# Altium schematic sheet DogBLDC.SchDoc
size 840 x 594 mm; DocumentTitle: Плата управления объективами; ProjectTitle: Плата управления питанием; PageSetup: Record=PageOptions|CenterHorizontal=True|CenterVertical=True|PrintScale=1.04|XCorrection=1.00|YCorrection=1.00|PrintKind=2|BorderSize=5000000|LeftOffset=0|BottomOffset=0|Orientation=2|PaperLength=1000|PaperWidth=1000|Scale=100|PaperSource=7|PrintQuality=600|MediaType=1|DitherType=10|PaperKind=Oversize A1|PrintScaleMode=1; Weight: -; ScaleFactor: -; NormInspection: Норм.Контр.
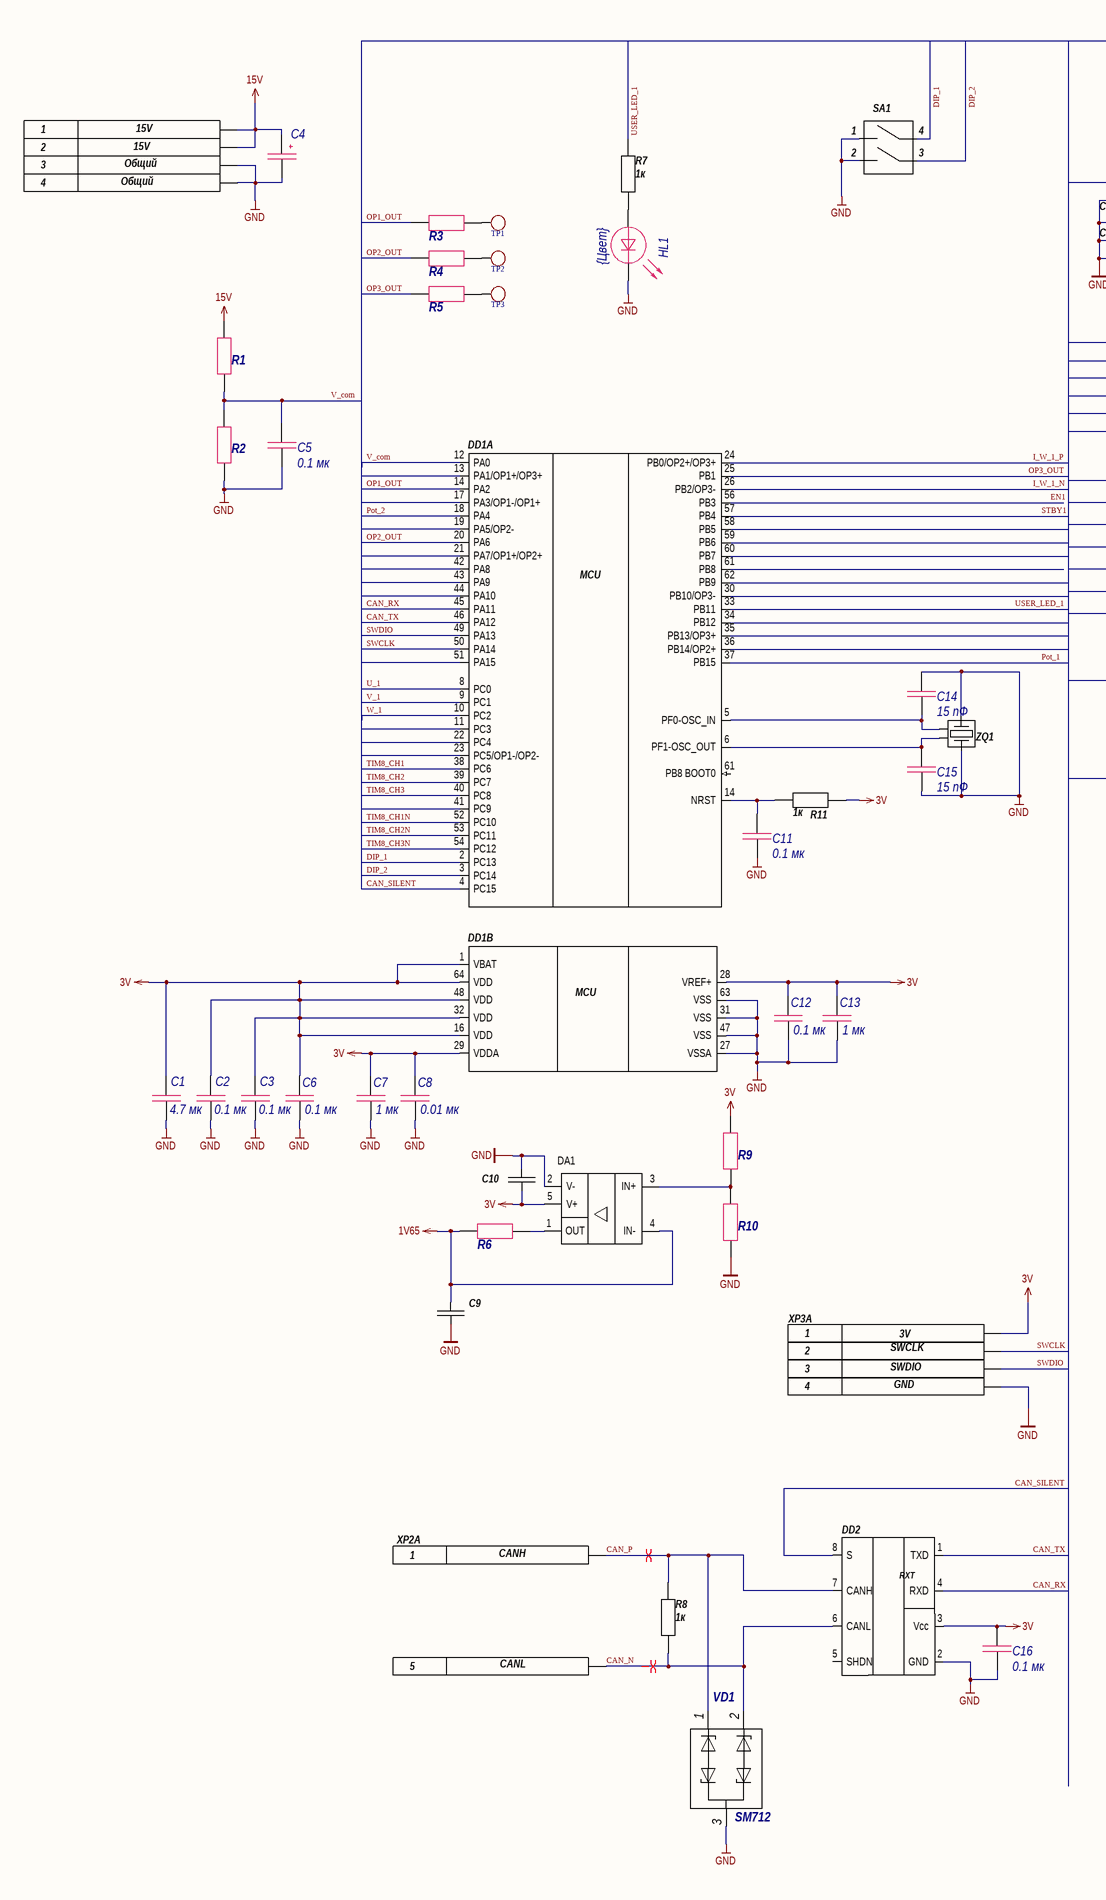
[diagram p0: DogBLDC.SchDoc, left]
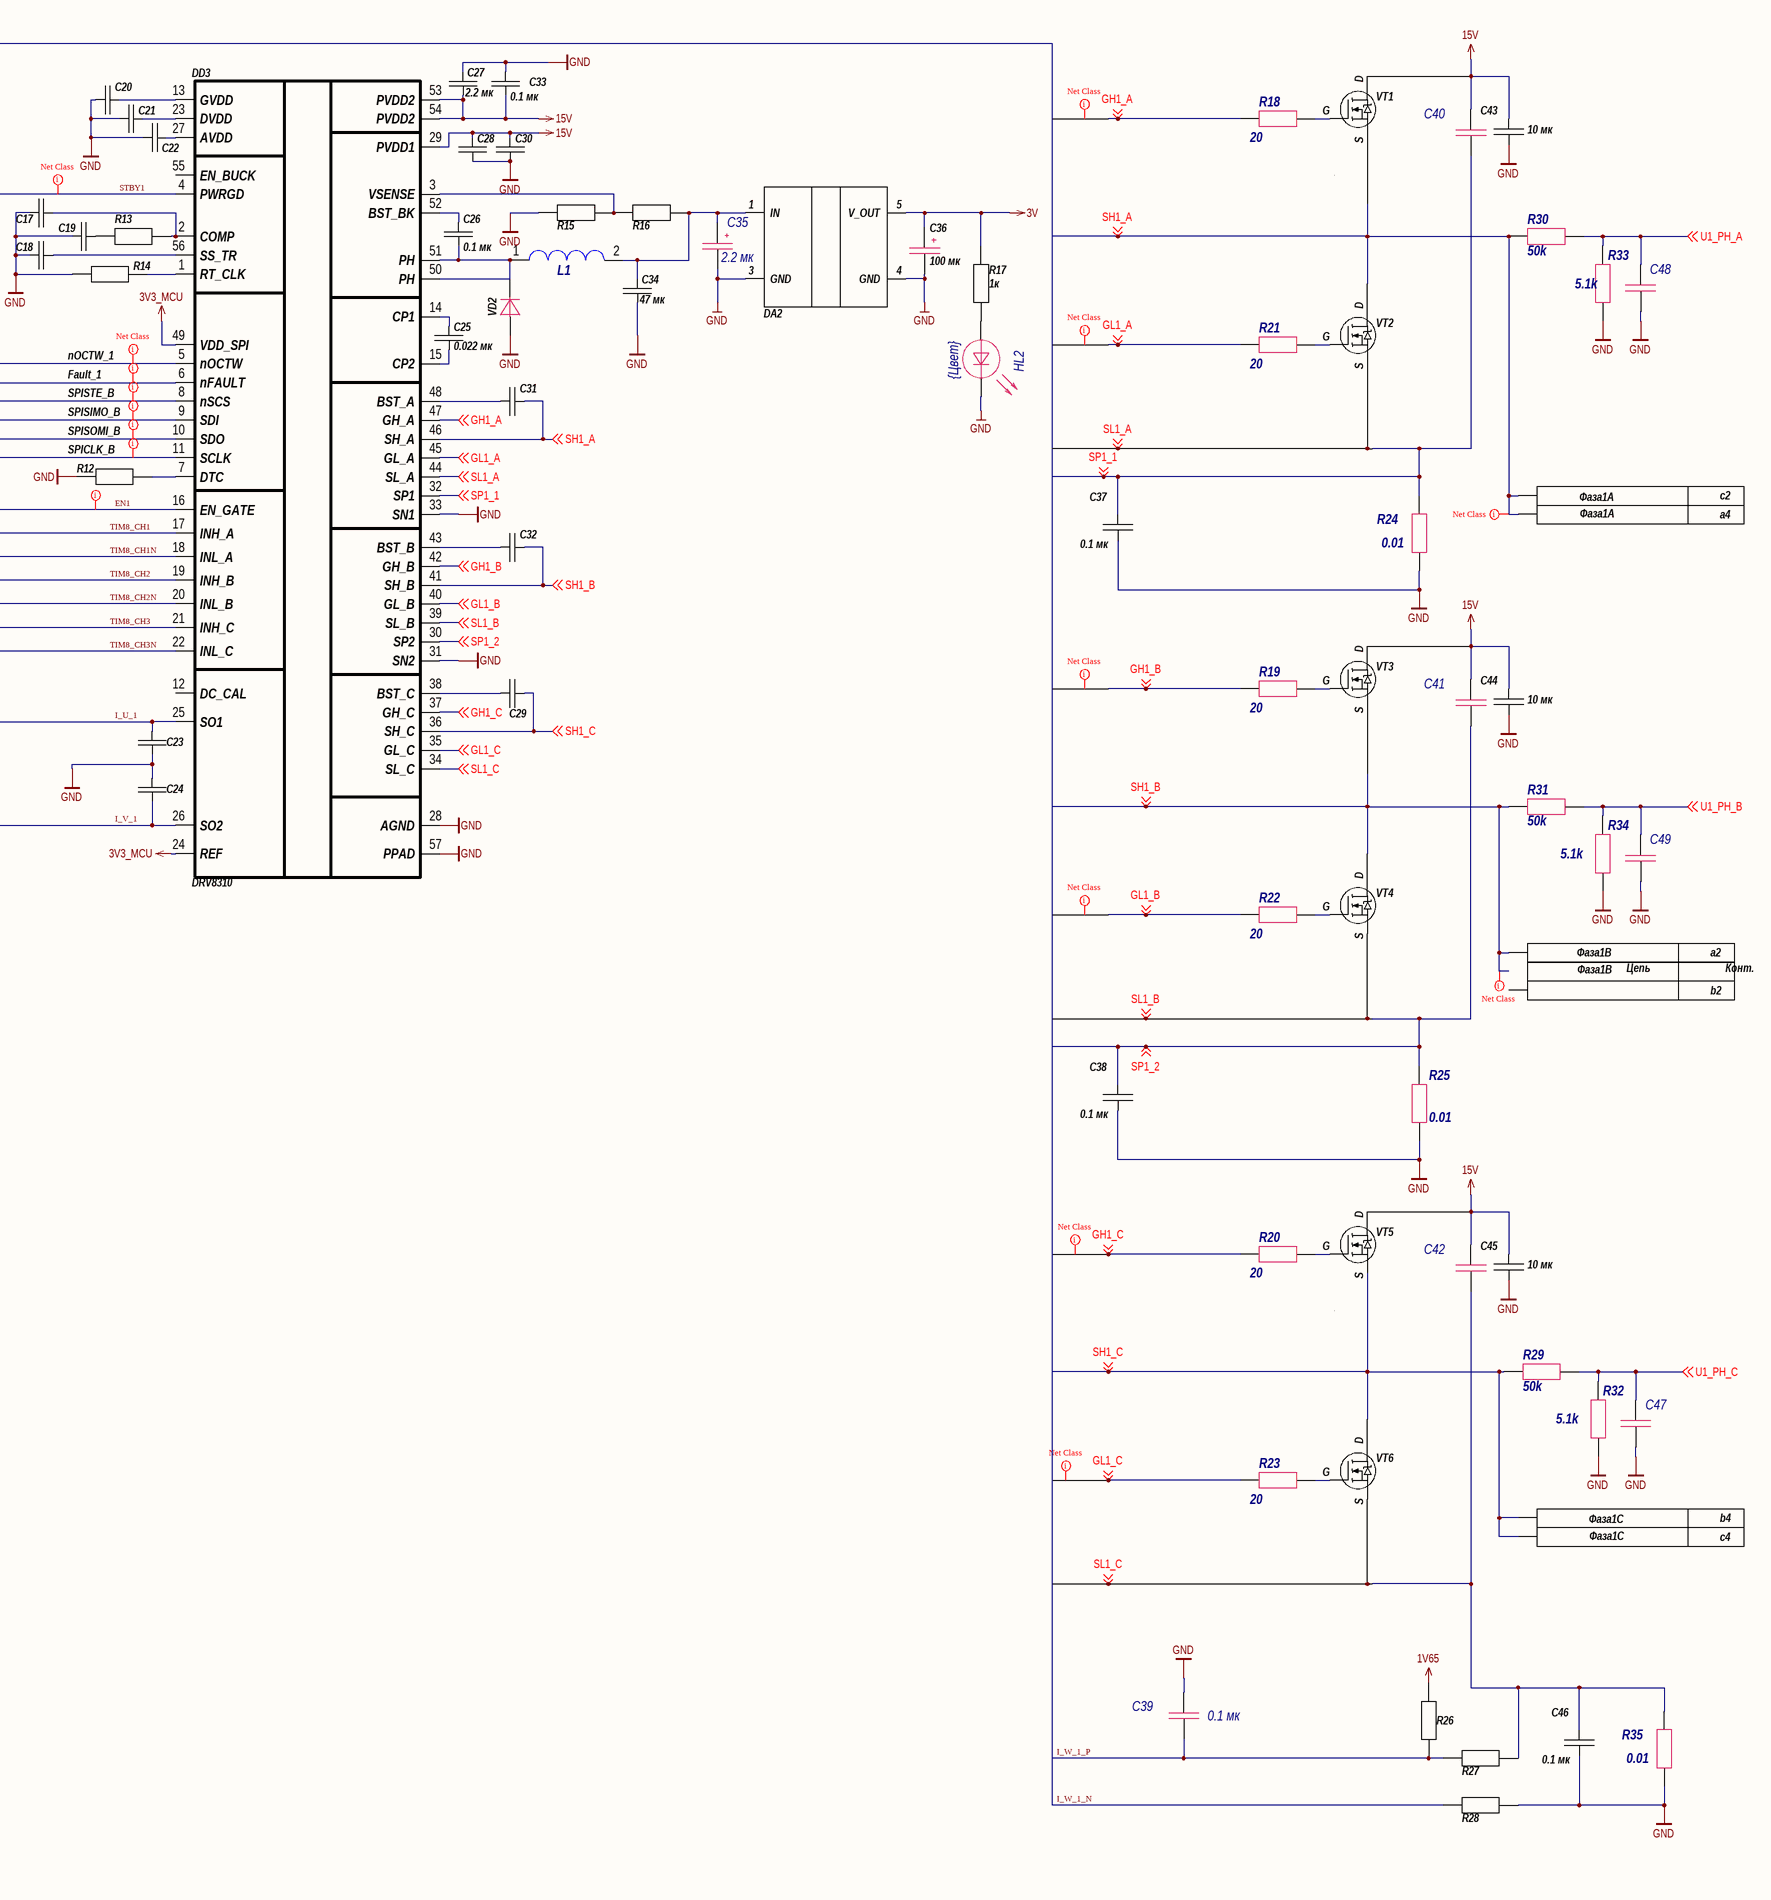
[diagram p1: DogBLDC.SchDoc, right]

## Parts
C1  value 4.7 мк  [0603cap]  (hidden comment: Capacitor)
C2  value 0.1 мк  [0603cap]  (hidden comment: Capacitor)
C3  value 0.1 мк  [0603cap]  (hidden comment: Capacitor)
C4  1uF  [TC_B (3528)]  (value not drawn)
C5  value 0.1 мк  [0603c]  (hidden comment: Capacitor)
C6  value 0.1 мк  [0603cap]  (hidden comment: Capacitor)
C7  value 1 мк  [0603cap]  (hidden comment: Capacitor)
C8  value 0.01 мк  [0603cap]  (hidden comment: Capacitor)
C9  C_1  [RES 0402]  (value not drawn)
C10  C_1  [RES 0402]  (value not drawn)
C11  value 0.1 мк  [0603cap]  (hidden comment: Capacitor)
C12  value 0.1 мк  [0603cap]  (hidden comment: Capacitor)
C13  value 1 мк  [0603cap]  (hidden comment: Capacitor)
C14  value 15 пФ  [0603cap]  (hidden comment: Capacitor)
C15  value 15 пФ  [0603cap]  (hidden comment: Capacitor)
C16  value 0.1 мк  [0603cap]  (hidden comment: Capacitor)
C17  C_1  [RES 0402]  (value not drawn)
C18  C_1  [RES 0402]  (value not drawn)
C19  C_1  [RES 0402]  (value not drawn)
C20  C_1  [0603c]  (value not drawn)
C21  C_1  [0603c]  (value not drawn)
C22  C_1  [0603c]  (value not drawn)
C23  C_1  [RES 0402]  (value not drawn)
C24  C_1  [RES 0402]  (value not drawn)
C25  value 0.022 мк  [0805]  (hidden comment: C_1)
C26  value 0.1 мк  [0603cap]  (hidden comment: C_1)
C27  value 2.2 мк  [1206 - duplicate]  (hidden comment: C_1)
C28  C_1  [0603cap]  (value not drawn)
C29  C_1  [0603cap]  (value not drawn)
C30  C_1  [0603cap]  (value not drawn)
C31  C_1  [0603cap]  (value not drawn)
C32  C_1  [0603cap]  (value not drawn)
C33  value 0.1 мк  [0603cap]  (hidden comment: C_1)
C34  value 47 мк  [1206 - duplicate]  (hidden comment: C_1)
C35  value 2.2 мк  [TC_A (3216)]  (hidden comment: 1uF)
C36  value 100 мк  [TC_D (7343)]  (hidden comment: 1uF)
C37  0.1 мк  [0603C]
C38  0.1 мк  [0603C]
C39  value 0.1 мк  [0603C]  (hidden comment: Capacitor)
C40  Capacitor  [CAP_2220]  (value not drawn)
C41  Capacitor  [CAP_2220]  (value not drawn)
C42  Capacitor  [CAP_2220]  (value not drawn)
C43  10 мк  [1812С]
C44  10 мк  [1812С]
C45  10 мк  [1812С]
C46  0.1 мк  [0603C]
C47  Capacitor  [RES 0402]  (value not drawn)
C48  Capacitor  [RES 0402]  (value not drawn)
C49  Capacitor  [RES 0402]  (value not drawn)
DA1  TLV2781  [SOT23-5]  (value not drawn)
DA2  TPS7B9xx  [SOT23_6_Pin]  (value not drawn)
DD1  STM32G431x6  [STM-LQFP64_L]  (value not drawn)  (parts A,B of 2)
DD2  TCAN337DCN  [SOT23-8]  (value not drawn)
DD3  DRV8310  [TSSOP50P810X120_HS-57N]
HL1  Color: {Цвет}  [0603D]
HL2  Color: {Цвет}  [0603D]
L1  DR74-330-R  [Inductor 6.3x6.3]  (value not drawn)
R1  Resistor  [RES 0402]  (value not drawn)
R2  Resistor  [RES 0402]  (value not drawn)
R3  Resistor  [RES 0402]  (value not drawn)
R4  Resistor  [RES 0402]  (value not drawn)
R5  Resistor  [RES 0402]  (value not drawn)
R6  Resistor  [RES 0402]  (value not drawn)
R7  value 1к  [0603res]  (hidden comment: Resistor)
R8  value 1к  [0603res]  (hidden comment: Resistor)
R9  Resistor  [RES 0402]  (value not drawn)
R10  Resistor  [RES 0402]  (value not drawn)
R11  value 1к  [0603res]  (hidden comment: Resistor)
R12  Resistor  [RES 0402]  (value not drawn)
R13  Resistor  [RES 0402]  (value not drawn)
R14  Resistor  [RES 0402]  (value not drawn)
R15  Resistor  [0603RES]  (value not drawn)
R16  Resistor  [0603RES]  (value not drawn)
R17  value 1к  [0603res]  (hidden comment: Resistor)
R18  value 20  [1206R]  (hidden comment: Resistor)
R19  value 20  [1206R]  (hidden comment: Resistor)
R20  value 20  [1206R]  (hidden comment: Resistor)
R21  value 20  [1206R]  (hidden comment: Resistor)
R22  value 20  [1206R]  (hidden comment: Resistor)
R23  value 20  [1206R]  (hidden comment: Resistor)
R24  value 0.01  [RES_LR2512]  (hidden comment: Resistor)
R25  value 0.01  [RES_LR2512]  (hidden comment: Resistor)
R26  Resistor  [RES 0402]  (value not drawn)
R27  Resistor  [RES 0402]  (value not drawn)
R28  Resistor  [RES 0402]  (value not drawn)
R29  value 50k  [0603R]  (hidden comment: Resistor)
R30  value 50k  [0603R]  (hidden comment: Resistor)
R31  value 50k  [0603R]  (hidden comment: Resistor)
R32  value 5.1k  [0603R]  (hidden comment: Resistor)
R33  value 5.1k  [0603R]  (hidden comment: Resistor)
R34  value 5.1k  [0603R]  (hidden comment: Resistor)
R35  value 0.01  [RES_LR2512]  (hidden comment: Resistor)
SA1  DIP переключатель 2  [SW-2]  (value not drawn)
TP1  TestPoint_1  [TP1]  (value not drawn)
TP2  TestPoint_1  [TP1]  (value not drawn)
TP3  TestPoint_1  [TP1]  (value not drawn)
VD1  SM712  [SOT23_true]
VD2  Diod  [SMB]  (value not drawn)
VT1  MOSFET GOST_PQFN5X6  [Power 5x6-8]  (value not drawn)
VT2  MOSFET GOST_PQFN5X6  [Power 5x6-8]  (value not drawn)
VT3  MOSFET GOST_PQFN5X6  [Power 5x6-8]  (value not drawn)
VT4  MOSFET GOST_PQFN5X6  [Power 5x6-8]  (value not drawn)
VT5  MOSFET GOST_PQFN5X6  [Power 5x6-8]  (value not drawn)
VT6  MOSFET GOST_PQFN5X6  [Power 5x6-8]  (value not drawn)
XP1  Value7: 15V  [G125-MS10605L3P]  (hidden comment: Конт.6_Вилка_ отд.контакты)  (parts A,B,C,D,E of 6)
XP2  Value1: CANH  [G125-MS10605L3P]  (hidden comment: Конт.6_Вилка_ отд.контакты)  (part A of 6)
XP3  Value1: 3V  Value2: SWCLK  Value3: SWDIO  Value4: GND  [PLL4]  (hidden comment: Конт.4_Single)  (parts A,B,C,D of 4)
XP4  Конт.48_Вилка_ отд.контакты  [DIN-Power E048MR-3,0C1-2-right_numbers]  (value not drawn)  (parts A,B,C,D,E,F of 48)
ZQ1  KX-7  [kx-7]  (value not drawn)

## Nets
1V65: C9.1 DA1.4(IN-) R6.2 R26.2
3V: C1.2 C2.2 C3.2 C6.2 C7.2 C8.2 C10.2 C12.2 C13.2 C16.2 C36.1 DA1.5(V+) DA2.5(V_OUT) DD1.1(VBAT) DD1.16(VDD) DD1.28(VREF+) DD1.29(VDDA) DD1.32(VDD) DD1.48(VDD) DD1.64(VDD) DD2.3(Vcc) R9.2 R11.1 R17.2 XP3.1
3V3_MCU: DD3.24(REF) DD3.49(VDD_SPI)
15V: C4.1 C27.1 C28.2 C30.2 C33.1 C40.1 C41.1 C42.1 C43.1 C44.1 C45.1 DD3.29(PVDD1) DD3.53(PVDD2) DD3.54(PVDD2) R1.1 VT1.D VT3.D VT5.D XP1.1 XP1.2
GND: C1.1 C2.1 C3.1 C4.2 C5.1 C6.1 C7.1 C8.1 C9.2 C10.1 C11.1 C12.1 C13.1 C14.2 C15.1 C16.1 C17.2 C18.2 C19.2 C20.1 C21.1 C22.1 C23.2 C24.1 C27.2 C28.1 C30.1 C33.2 C34.1 C35.2 C36.2 C37.2 C38.2 C39.1 C43.2 C44.2 C45.2 C46.2 C47.2 C48.2 C49.2 DA1.2(V-) DA2.3(GND) DA2.4(GND) DD1.27(VSSA) DD1.31(VSS) DD1.47(VSS) DD1.63(VSS) DD2.2(GND) DD3.28(AGND) DD3.31(SN2) DD3.33(SN1) DD3.57(PPAD) HL1.2 HL2.2 R2.2 R10.1 R12.1 R14.1 R15.2 R24.1 R25.1 R28.2 R32.2 R33.2 R34.2 R35.1 SA1.1 SA1.2 VD1.3(GND) VD2.1 XP1.3 XP1.4 XP3.4 ZQ1.1(XTAL1) ZQ1.3(XTAL2)
CAN_N: DD2.6(CANL) R8.1 VD1.2(IN2) XP1.5
CAN_P: DD2.7(CANH) R8.2 VD1.1(IN1) XP2.1
CAN_RX: DD1.45(PA11) DD2.4(RXD)
CAN_SILENT: DD1.4(PC15) DD2.8(S)
CAN_TX: DD1.46(PA12) DD2.1(TXD)
DIP_1: DD1.2(PC13) SA1.4
DIP_2: DD1.3(PC14) SA1.3
EN1: DD1.56(PB3) DD3.16(EN_GATE)
Fault_1: DD3.6(nFAULT)
GH1_A: DD3.47(GH_A) R18.1 ; off-sheet GH1_A
GH1_B: DD3.42(GH_B) R19.1 ; off-sheet GH1_B
GH1_C: DD3.37(GH_C) R20.1 ; off-sheet GH1_C
GL1_A: DD3.45(GL_A) R21.1 ; off-sheet GL1_A
GL1_B: DD3.40(GL_B) R22.1 ; off-sheet GL1_B
GL1_C: DD3.35(GL_C) R23.1 ; off-sheet GL1_C
I_U_1: C23.1 DD3.25(SO1)
I_V_1: C24.2 DD3.26(SO2)
I_W_1_N: DD1.26(PB2/OP3-) R28.1
I_W_1_P: C39.2 DD1.24(PB0/OP2+/OP3+) R26.1 R27.1
nOCTW_1: DD3.5(nOCTW)
OP1_OUT: DD1.14(PA2) R3.2
OP2_OUT: DD1.20(PA6) R4.2
OP3_OUT: DD1.25(PB1) R5.2
Pot_1: DD1.37(PB15)
Pot_2: DD1.18(PA4)
SH1_A: C31.1 DD3.46(SH_A) R30.1 VT1.S VT2.D XP4.a4 XP4.c2 ; off-sheet SH1_A
SH1_B: C32.1 DD3.41(SH_B) R31.1 VT3.S VT4.D XP4.a2 ; off-sheet SH1_B
SH1_C: C29.1 DD3.36(SH_C) R29.1 VT5.S VT6.D XP4.b4 XP4.c4 ; off-sheet SH1_C
SL1_A: C37.1 C40.2 DD3.32(SP1) DD3.44(SL_A) R24.2 VT2.S ; off-sheet SP1_1, off-sheet SL1_A  [also labelled SP1_1]
SL1_B: C38.1 C41.2 DD3.30(SP2) DD3.39(SL_B) R25.2 VT4.S ; off-sheet SL1_B, off-sheet SP1_2  [also labelled SP1_2]
SL1_C: C42.2 C46.1 DD3.34(SL_C) R27.2 R35.2 VT6.S ; off-sheet SL1_C
SPICLK_B: DD3.11(SCLK)
SPISIMO_B: DD3.9(SDI)
SPISOMI_B: DD3.10(SDO)
SPISTE_B: DD3.8(nSCS)
STBY1: DD1.57(PB4) DD3.4(PWRGD)
SWCLK: DD1.50(PA14) XP3.2
SWDIO: DD1.49(PA13) XP3.3
TIM8_CH1: DD1.38(PC6) DD3.17(INH_A)
TIM8_CH1N: DD1.52(PC10) DD3.18(INL_A)
TIM8_CH2: DD1.39(PC7) DD3.19(INH_B)
TIM8_CH2N: DD1.53(PC11) DD3.20(INL_B)
TIM8_CH3: DD1.40(PC8) DD3.21(INH_C)
TIM8_CH3N: DD1.54(PC12) DD3.22(INL_C)
U1_PH_A: C48.1 R30.2 R33.1 ; off-sheet U1_PH_A
U1_PH_B: C49.1 R31.2 R34.1 ; off-sheet U1_PH_B
U1_PH_C: C47.1 R29.2 R32.1 ; off-sheet U1_PH_C
U_1: DD1.8(PC0)
USER_LED_1: DD1.33(PB11) R7.2
V_1: DD1.9(PC1)
V_com: C5.2 DD1.12(PA0) R1.2 R2.1
W_1: DD1.10(PC2)
NetC11_2: C11.2 DD1.14(NRST) R11.2
NetC14_1: C14.1 DD1.5(PF0-OSC_IN) ZQ1.4(XTAL2)
NetC15_2: C15.2 DD1.6(PF1-OSC_OUT) ZQ1.2(XTAL2)
NetC17_1: C17.1 DD3.2(COMP) R13.2
NetC18_1: C18.1 DD3.56(SS_TR)
NetC19_1: C19.1 R13.1
NetC20_2: C20.2 DD3.13(GVDD)
NetC21_2: C21.2 DD3.23(DVDD)
NetC22_2: C22.2 DD3.27(AVDD)
NetC25_1: C25.1 DD3.15(CP2)
NetC25_2: C25.2 DD3.14(CP1)
NetC26_1: C26.1 DD3.50(PH) DD3.51(PH) L1.1 VD2.2
NetC26_2: C26.2 DD3.52(BST_BK)
NetC29_2: C29.2 DD3.38(BST_C)
NetC31_2: C31.2 DD3.48(BST_A)
NetC32_2: C32.2 DD3.43(BST_B)
NetC34_2: C34.2 C35.1 DA2.1(IN) L1.2 R16.1
NetDA1_1: DA1.1(OUT) R6.1
NetDA1_3: DA1.3(IN+) R9.1 R10.2
NetDD3_1: DD3.1(RT_CLK) R14.2
NetDD3_3: DD3.3(VSENSE) R15.1 R16.2
NetDD3_7: DD3.7(DTC) R12.2
NetHL1_1: HL1.1 R7.1
NetHL2_1: HL2.1 R17.1
NetR3_1: R3.1 TP1.1
NetR4_1: R4.1 TP2.1
NetR5_1: R5.1 TP3.1
NetR18_2: R18.2 VT1.G
NetR19_2: R19.2 VT3.G
NetR20_2: R20.2 VT5.G
NetR21_2: R21.2 VT2.G
NetR22_2: R22.2 VT4.G
NetR23_2: R23.2 VT6.G

Not connected (* = marked no-connect by the designer): DD1 11(PC3) 13(PA1/OP1+/OP3+) 17(PA3/OP1-/OP1+) 19(PA5/OP2-) 21(PA7/OP1+/OP2+) 22(PC4) 23(PC5/OP1-/OP2-) 30(PB10/OP3-) 34(PB12) 35(PB13/OP3+) 36(PB14/OP2+) 41(PC9) 42(PA8) 43(PA9) 44(PA10) 51(PA15) 58(PB5) 59(PB6) 60(PB7) 61(PB8) 62(PB9); DD2 5(SHDN); DD3 12(DC_CAL) 55(EN_BUCK); XP4 b2

## Layout directives
differential pair: CAN_N, CAN_P
net class SIGNAL_DIGITAL: EN1, Fault_1, GH1_A, GH1_B, GH1_C, GL1_A, GL1_B, GL1_C, nOCTW_1, SPICLK_B, SPISIMO_B, SPISOMI_B, SPISTE_B, STBY1
net class POWER: SH1_A, SH1_B

## Notes on the sheet
- Фаза1А
- Фаза1B
- Фаза1C
- Labels drawn without touching a wire or pin: Взам.инв.№, Инв.№ дубл., Инв.№ подл., Перв. примен., Подп. и дата, Справ №
- Text
- Изм.
- Лист
- № докум.
- Подп.
- Дата
  Дата
- Литера
- Масса
- Масштаб
- Т.контр.
- Пров.
- Разраб.
- принципиальная
- Схема электрическая
- Листов 1
- Н.контр.
- Утв.
- Копировал
- Формат А1
- (in symbol STM32G431x6, part A) MCU
- (in symbol STM32G431x6, part B) MCU
- (in symbol TCAN337DCN) RXT
- (in symbol Конт.48_Вилка_ отд.контакты, part B) Цепь; Конт.

## Library data of the parts
C1-C3 C5-C8 C11-C13 C16 = Capacitor: Rate: 16В; Case: 0603
C4 C35 = Capacitor_pol: Rate: 16В
C9 C10 = C_1: Rate: 6.3В; Designator: C?; Type: Чип-конденсатор; Value: 2.2 мк; Tolerance: 10 %; Case: 0402
C17 = C_1: Rate: 16В; Designator: C?; Type: Чип-конденсатор; Value: 39 пФ; Tolerance: 5 %; Case: 0402
C18 = C_1: Rate: 16В; Designator: C?; Type: Чип-конденсатор; Value: 0.015 мк; Tolerance: 5 %; Case: 0402
C19 = C_1: Rate: 16В; Designator: C?; Type: Чип-конденсатор; Value: 6800 пФ; Tolerance: 10 %; Case: 0402
C20 = C_1: Rate: 16В; Designator: C?; Type: Чип-конденсатор; Value: 2.2 мк; Tolerance: 10 %; Case: 0603
C21 C22 = C_1: Rate: 10В; Designator: C?; Type: Чип-конденсатор; Value: 1 мк; Tolerance: 10 %; Case: 0603
C23 C24 = C_1: Rate: 16В; Designator: C?; Type: Чип-конденсатор; Value: 0.1 мк; Tolerance: 10 %; Case: 0402
C25 C26 C34 = C_1: Rate: 16В; Designator: C?; Type: Чип-конденсатор; Tolerance: 10 %
  C25: Case: 0805
  C26: Case: 0603
  C34: Case: 1206
C27 C33 = C_1: Rate: 100В; Designator: C?; Type: Чип-конденсатор; Tolerance: 10 %
  C27: Case: 1206
  C33: Case: 0603
C28 C30 = C_1: Rate: 100В; Designator: C?; Type: Чип-конденсатор; Value: 0.1 мк; Tolerance: 10 %; Case: 0603
C29 C31 C32 = C_1: Rate: 50В; Designator: C?; Type: Чип-конденсатор; Value: 0.1 мк; Tolerance: 10 %; Case: 0603
C36 = Capacitor_pol: Rate: 10В; Type: Чип-конденсатор танталовый; Tolerance: 10 %; Case: D
C37 C38 C46 = C: Rate: 16В; Designator: C?; Type: Чип-конденсатор; Tolerance: 10 %; Value: 0.1 мк
  C37 C38: Case: 0402
  C46: Case: 0603
C39 = Capacitor: Rate: 16В; Designator: C?; Type: Чип-конденсатор; Tolerance: 10 %; Case: 0402
C40-C42 = Capacitor: Manufacture: KEMET; Value: 0.047 мк F3078 LDE-1103670; Type: Конденсатор пленочный; Case: 2220
C43-C45 = C: Rate: 100В; Type: Чип-конденсатор; Tolerance: 10 %; Value: 10 мк; Case: 1812
C47-C49 = Capacitor: Rate: 16В; Value: 0.1 мк; Designator: C?; Type: Чип-конденсатор; Tolerance: 10 %; Case: 0402
DA1 = TLV2781: Manufacture: TI; Value: TLV2781
DA2 = TPS7B9xx: Manufacture: TI; Value: TPS7B6933DBVR; CASE: SOT23
DD1 = STM32G431x6: ARM Cortex-M4 32-bit MCU+FPU, 210 DMIPS, 512 kB Flash, 192 kB Internal RAM, 82 I/Os, 100-pin LQFP, -40 to 85 degC, Tray; Manufacturer: STMicroelectronics; PartNumber: STM32F407VET6; D/A Converter: 2x12-bit; FLASH Size (Prog) (kB): 512; I/Os (High Current): 82; Internal RAM Size (kB): 192; Operating Frequency(F) (Processor speed) (MHz): 168; Supply Voltage(Vcc) max (V): 3.6; Supply Voltage(Vcc) min (V): 1.8; DatasheetVersion: Rev. 4; PackageVersion: Rev. 1, 06/2013; PackageReference: LQFP100; PackageDescription: 100-Pin Low Profile Quad Flat Package, 14 x 14 mm Body, 0.5 mm Pitch; Supplier 1: Digi-Key; Supplier Part Number 1: 497-12075-ND; Supplier 2: Farnell; Supplier Part Number 2: 2064367; Supplier 3: Newark; Supplier Part Number 3: 73T2332; Supplier 4: Mouser; Supplier Part Number 4: 511-STM32F407VET6; Core: ARM Cortex-M4; Packing: Tray; Mounting Technology: Surface Mount; ComponentLink1Description: Manufacturer URL; ComponentLink1URL: http://www.st.com/web/en/home.html; ComponentLink2Description: Datasheet; ComponentLink2URL: http://www.st.com/st-web-ui/static/active/en/resource/technical/document/datasheet/DM00037051.pdf; ComponentLink3Description: Package Specification; ComponentLink3URL: http://www.st.com/st-web-ui/static/active/en/resource/technical/document/data_brief/DM00071938.pdf
DD3 = DRV8301: Manufacture: Texas Instruments; Value: DRV8301DCAR
HL1 HL2 = LED: Manufacturer: -; Rate: -; Datasheet: -; Shop: -; Notice: -; Case: -
L1 = Inductance: Manufacture: Eaton Coiltronics; Value: DR74-330-R
R1-R6 = Resistor: Value: 10; Tolerance: 5 %; Case: 0402; Type: Чип-резистор
R9 R10 = Resistor: Value: 10k; Tolerance: 0.1%; Case: 0402; Type: Чип-резистор
R12 = Resistor: Value: 0; Tolerance: 10 %; Manufacture: *; Docum: *; Type: Чип-резистор; Case: 0402
R13 = Resistor: Value: 28к; Tolerance: 0.1 %; Manufacture: *; Docum: *; Type: Чип-резистор; Case: 0402
R14 = Resistor: Value: 205k; Tolerance: 0.1 %; Manufacture: *; Docum: *; Type: Чип-резистор; Case: 0402
R15 = Resistor: Value: 10k; Tolerance: 1 %; Manufacture: *; Docum: *; Type: Чип-резистор; Case: 0603
R16 = Resistor: Value: 53.6k; Tolerance: 1 %; Manufacture: *; Docum: *; Type: Чип-резистор; Case: 0603
R18-R23 = Resistor: Tolerance: 10 %; Case: 1206; Type: Чип-резистор
R24 R25 R35 = Resistor: Manufacture: Vishay; Rate: 2 Вт; Case: LR2512; Type: Чип-резистор
R26 = Resistor: Value: 20k; Tolerance: 0.1%; Type: Чип-резистор; Case: 0402
R27 R28 = Resistor: Value: 1к; Tolerance: 0.1%; Type: Чип-резистор; Case: 0402
R29-R34 = Resistor: Tolerance: 1 %; Case: 0603; Type: Чип-резистор
VD1 = SM712: Manufactore: SEMTECH; Notice: Защита RS-485; Rate: 12В; Datasheet: http://www.semtech.com/images/datasheet/sm712.pdf; Shop: https://www.chipdip.ru/product/sm712.tct; Case: SOT23; Value: SM712
VD2 = Diod: Manufacture: Pun Jit Semiconductor; Value: S100; Type: Диод Шоттки; Case: SMA
VT1-VT6 = MOSFET GOST_PQFN5X6: Manufacture: ONS; Designator: VT?; Rate: 100В, 72А; Type: MOSFET N; Value: NTMFS10N7D2C; Case: PQFN5x6
XP1 = Конт.6_Вилка_ отд.контакты: Manufacture: Harting; Designator: XP?; Value5: Общий; Value9: CANL; Value1: CANH; Docum: *; Value3: *; Value6: Общий; Value8: 15V; Value10: *; Value11: *; Value12: *; Value13: *; Value14: *; Value4: *; Value25: *; Value26: *; Value27: *; Value28: *; Value29: *; Value30: *; Value31: *; Value32: *; Value2: *; Value15: *; Value16: *; Value17: *; Value18: *; Value19: *; Value20: *; Value21: *; Value23: *; Value24: *; Value33: *; Value34: *; Value35: *; Value36: *; Value37: *; Value38: *; Value39: *; Value41: *; Value42: *; Value43: *; Value44: *; Value45: *; Value46: *; Value47: *; Value48: *
XP2 = Конт.6_Вилка_ отд.контакты: Manufacture: Harting; Designator: XP?; Value5: Общий; Value7: 15V; Value9: CANL; Docum: *; Value3: *; Value6: Общий; Value8: 15V; Value10: *; Value11: *; Value12: *; Value13: *; Value14: *; Value4: *; Value25: *; Value26: *; Value27: *; Value28: *; Value29: *; Value30: *; Value31: *; Value32: *; Value2: *; Value15: *; Value16: *; Value17: *; Value18: *; Value19: *; Value20: *; Value21: *; Value23: *; Value24: *; Value33: *; Value34: *; Value35: *; Value36: *; Value37: *; Value38: *; Value39: *; Value41: *; Value42: *; Value43: *; Value44: *; Value45: *; Value46: *; Value47: *; Value48: *
XP3 = Конт.4_Single_1: Value5: *
XP4 = Конт.48_Вилка_ отд.контакты: Manufacture: Harting; Designator: XP?; Value: 09 05 348 6920; Docum: *; Value3: *; Value5: *; Value6: *; Value7: *; Value8: *; Value9: *; Value4: *; Value25: *; Value26: *; Value27: *; Value28: *; Value29: *; Value30: *; Value31: *; Value32: *; Value20: *; Value21: *; Value22: *; Value23: *; Value24: *; Value33: *; Value34: *; Value35: *; Value36: *; Value37: *; Value38: *; Value39: *; Value40: *; Value41: *; Value42: *; Value43: *; Value44: *; Value45: *; Value46: *; Value47: *; Value48: *; Type: Вилка на плату
ZQ1 = XTAL_4(KX-7): Manufacture: Geyer; Rate: 20.000 кГц; Name: *; Value: KX-7; Type: KX-7
R7 R8 R11 R17 = Resistor: Manufacture: *; Docum: *; Type: *
SA1 = DIP переключатель 2: Value: *